# Altium project rpi_adapter.PrjPcb
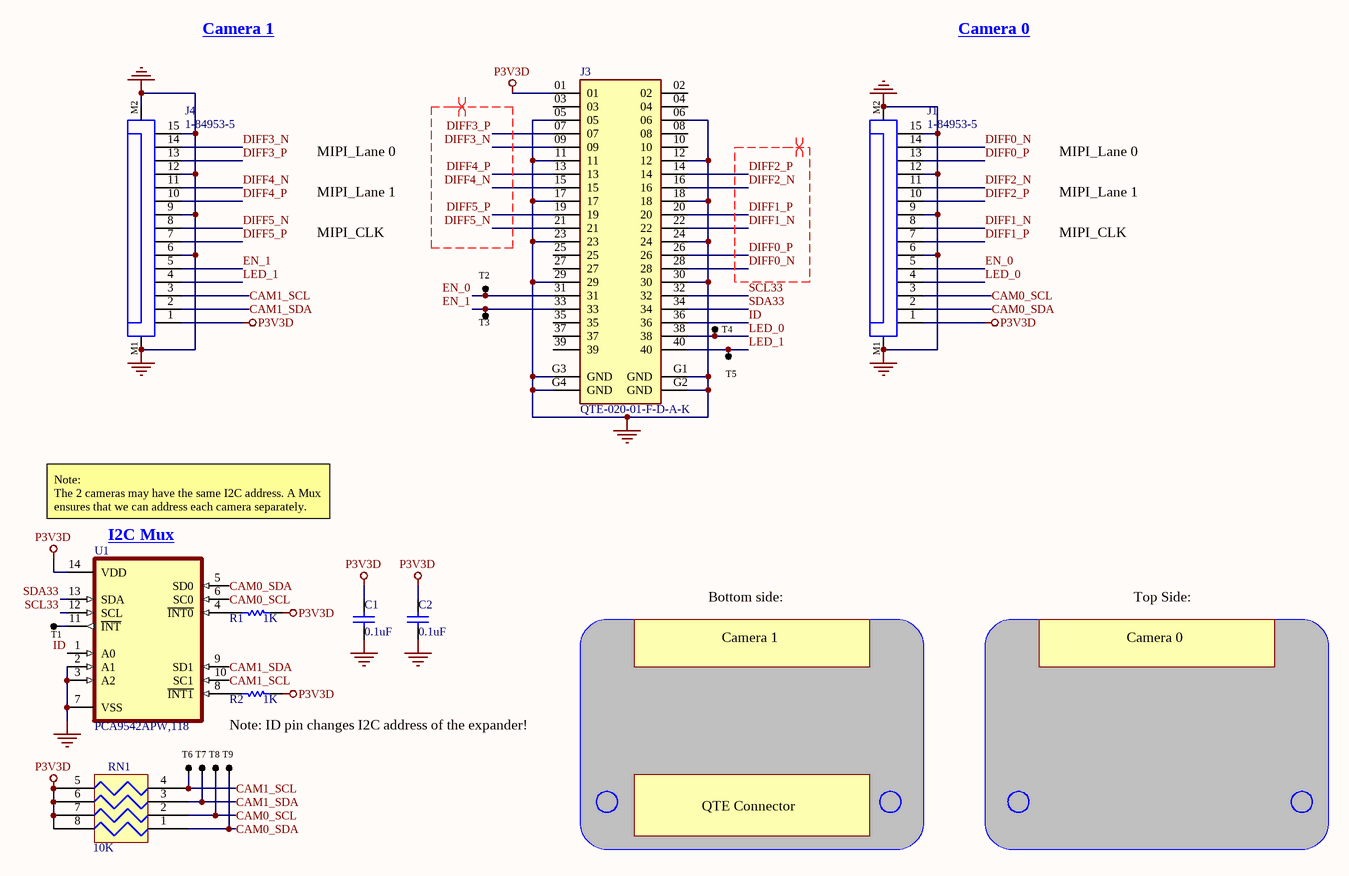
[diagram p0: rpi_adapter_2x4L_sink.SchDoc]
SCH_NAME: tinyDualRPi Adapter; REV: v2.0; PCB_NAME: tinyDualRPi Adapter
1 sheet, 18 parts. Net scope: global (net labels, ports and power ports of the same name join across sheets).
Board file: rpi_adapter.PcbDoc

## Sheet rpi_adapter_2x4L_sink.SchDoc
size B; SheetNumber: 1; SheetTotal: 1

### Parts
C1  0.1uF  [CAPC1005X55USR]
C2  0.1uF  [CAPC1005X55USR]
J1  1-84953-5  [TE_1-84953-5]
J3  QTE-020-01-F-D-A-K  [SAMTEC_QTE-020-01-X-D-A]
J4  1-84953-5  [TE_1-84953-5]
R1  1K  [RESC1005X40USR]
R2  1K  [RESC1005X40USR]
RN1  10K  [RESCAXS50P100X200X45-8NA]
T1  TP_S  [TP 1mm]  (value not drawn)  (no BOM)
T2  TP_S  [TP 1mm]  (value not drawn)  (no BOM)
T3  TP_S  [TP 1mm]  (value not drawn)  (no BOM)
T4  TP_S  [TP 1mm]  (value not drawn)  (no BOM)
T5  TP_S  [TP 1mm]  (value not drawn)  (no BOM)
T6  TP_S  [TP 1mm]  (value not drawn)  (no BOM)
T7  TP_S  [TP 1mm]  (value not drawn)  (no BOM)
T8  TP_S  [TP 1mm]  (value not drawn)  (no BOM)
T9  TP_S  [TP 1mm]  (value not drawn)  (no BOM)
U1  PCA9542APW,118  [SOP65P640X110-14N]

### Nets
GND: C1.1 C2.1 J1.6 J1.9 J1.12 J1.15 J1.M1 J1.M2 J3.05 J3.06 J3.11 J3.12 J3.17 J3.18 J3.23 J3.24 J3.29 J3.30 J3.G1(GND) J3.G2(GND) J3.G3(GND) J3.G4(GND) J4.6 J4.9 J4.12 J4.15 J4.M1 J4.M2 U1.2(A1) U1.3(A2) U1.7(VSS)
P3V3D: C1.2 C2.2 J1.1 J3.01 J4.1 R1.2 R2.2 RN1.5 RN1.6 RN1.7 RN1.8 U1.14(VDD)
CAM0_SCL: J1.3 RN1.2 T8.1 U1.6(SC0)
CAM0_SDA: J1.2 RN1.1 T9.1 U1.5(SD0)
CAM1_SCL: J4.3 RN1.4 T6.1 U1.10(SC1)
CAM1_SDA: J4.2 RN1.3 T7.1 U1.9(SD1)
DIFF0_N: J1.14 J3.28
DIFF0_P: J1.13 J3.26
DIFF1_N: J1.8 J3.22
DIFF1_P: J1.7 J3.20
DIFF2_N: J1.11 J3.16
DIFF2_P: J1.10 J3.14
DIFF3_N: J3.09 J4.14
DIFF3_P: J3.07 J4.13
DIFF4_N: J3.15 J4.11
DIFF4_P: J3.13 J4.10
DIFF5_N: J3.21 J4.8
DIFF5_P: J3.19 J4.7
EN_0: J1.5 J3.31 T2.1
EN_1: J3.33 J4.5 T3.1
ID: J3.36 U1.1(A0)
LED_0: J1.4 J3.38 T4.1
LED_1: J3.40 J4.4 T5.1
SCL33: J3.32 U1.12(SCL)
SDA33: J3.34 U1.13(SDA)
NetR1_1: R1.1 U1.4(~{INT0})
NetR2_1: R2.1 U1.8(~{INT1})
NetT1_1: T1.1 U1.11(~{INT})

Not connected (* = marked no-connect by the designer): J3 02 03 04 08 10 25 27 35 37 39

### Layout directives
differential pair: DIFF0_N, DIFF0_P, DIFF1_N, DIFF1_P, DIFF2_N, DIFF2_P, DIFF3_N, DIFF3_P, DIFF4_N, DIFF4_P, DIFF5_N, DIFF5_P

### Notes on the sheet
- Camera 1
- Camera 0
- MIPI_Lane 0
- MIPI_CLK
- MIPI_Lane 1
- Note:
  The 2 cameras may have the same I2C address. A Mux ensures that we can address each camera separately.
- (near U1) I2C Mux
- Bottom side:
- Top Side:
- Note: ID pin changes I2C address of the expander!
- QTE Connector

### Library data of the parts
C1 C2 = CAP CER 0.1UF 16V X7R 0402: Manufacturer Part Number: CGA2B1X7R1C104K050BC; Manufacturer: TDK Corporation; Supplier Part Number 1: 445-5613-2-ND; Package: 0402; Height: 0.55mm; Supplier 1: Digi-Key; value: 0.1uF
J1 J4 = FPC - 15P - 2MP: Conn FPC Connector SKT 15 POS 1mm Solder RA SMD T/R; Manufacturer: TE Connectivity; Actuator Material: Nylon,Glass,Polyamide; Actuator Color: Black; Voltage Rating: 200V; Number of Contacts: 15; Current Rating: 1A; Gender: Receptacle; Wire/Cable Type: Flat Flex; Shielding: Unshielded; Connector Type: Receptacle,Connector,Socket; Connector System: Flex-to-Board; Mating Alignment: Yes (With); PCB Mount Alignment: No (Without); PCB Mount Retention: With; Contact Location: Top; PCB Mounting Orientation: Right Angle; Pitch: 0.039inch; Plating Thickness: 2um; Supplier 1: Digi-Key; Supplier Part Number 1: A101405CT-ND; Manufacturer Part Number: 1-84953-5; RoHS: Yes; Category: FFC / FPC; Stock 1: 9836; Pricing 1: 1=1.02000, 10=0.97700, 25=0.93400, 50=0.92100, 100=0.80470, 250=0.77460, 500=0.73158 (USD); Mount: Surface Mount; Contact Plating: Tin,Bright; Contact Material: Bronze; Housing Color: Natural; Housing Material: Polymer; Min Operating Temperature: -40°C; Max Operating Temperature: 85°C; Termination: SMD/SMT; Packaging: Tape and Reel; Number of Rows: 1; Package Quantity: 1200; Orientation: Right Angle; Series: FPC; Number of Positions: 15; Sealable: No (Without); Shrouded: Yes (With); Contact Current Rating: 1A; Max Voltage Rating (AC): 200V; Length: 22.92mm; Width: 0.2575inch; Height: 2.56mm; Depth: 7.3mm; Radiation Hardening: No; RoHS Compliant: Yes; Flammability Rating: UL94 V-0; ELV: Compliant; ComponentLink1URL: https://datasheet.ciiva.com/669/eng-cd-84953-a3-669110.pdf?src-supplier=Digi-Key; ComponentLink1Description: https://datasheet.ciiva.com/669/eng-cd-84953-a3-669110.pdf?src-supplier=Digi-Key; ComponentLink2URL: https://datasheet.ciiva.com/669/eng-cd-84953-a3-669111.pdf?src-supplier=Digi-Key; ComponentLink2Description: https://datasheet.ciiva.com/669/eng-cd-84953-a3-669111.pdf?src-supplier=Digi-Key; ComponentLink3URL: https://datasheet.ciiva.com/669/eng-cd-84953-a3-669112.pdf?src-supplier=Digi-Key; ComponentLink3Description: https://datasheet.ciiva.com/669/eng-cd-84953-a3-669112.pdf?src-supplier=Digi-Key
J3 = QSE-020-01-F-D-A-K: Q Strip® High-Speed Ground Plane Header, 0.80mm Pitch; Manufacturer: Samtec; Number of Positions: 40; Gender: Male; Pitch: 0.031inch; Mated Stacking Heights: 5mm; Supplier 1: Digi-Key; Supplier Part Number 1: SAM8846-ND; Manufacturer Part Number: QTE-020-01-F-D-A; RoHS: Yes; Category: Board to Board Connectors; Stock: 179; Pricing: 1=5.61000, 10=5.09400, 25=4.82480, 40=4.71275, 80=4.48825, 230=3.92726, 440=3.81505, 945=3.25402, 2400=3.02960 (USD); Mounting Technology: Surface Mount; Contact Plating: Gold; Number of Rows: 2; Packaging: Tray; Termination: Solder; Number of Contacts: 40; Series: QStrip® QTE; Package Quantity: 1; RoHS Compliant: Yes; ComponentLink1URL: https://datasheet.ciiva.com/6924/qte-xxx-xx-x-d-xxx-mkt-6924765.pdf?src-supplier=Digi-Key; ComponentLink1Description: https://datasheet.ciiva.com/6924/qte-xxx-xx-x-d-xxx-mkt-6924765.pdf?src-supplier=Digi-Key
R1 R2 = RES 1K OHM 1% 1/16W 0402: RES SMD 1K OHM 1% 1/16W 0402; Manufacturer: YAGEO; Manufacturer Part Number: RC0402FR-071KL; Supplier Part Number 1: 311-1.00KLRCT-ND; Package: 0402; Height: 0.4mm; Supplier 1: Digi-Key; value: 1K
RN1 = RES ARRAY 4 RES 47K OHM 0804: Res Thick Film Array 10K Ohm 5% ±200ppm/°C ISOL 8-Pin 0804(4 X 0402) Convex SMD Automotive T/R; Manufacturer: Panasonic; Manufacturer Part Number: EXB-28V103JX; Number of Resistors: 4; Power Dissipation: 63mW; Voltage Rating: 50V; Circuit Type: Isolated; Power Per Element: 62.5mW; Number of Contacts: 8; Voltage Rating (DC): 100V; Supplier 1: Digi-Key; Supplier Part Number 1: Y7103CT-ND; RoHS: Yes; Category: Resistor Arrays; Stock: 1570078; Pricing: 1=0.10000, 10=0.08100, 25=0.05640, 50=0.04380, 100=0.03130, 250=0.02444, 500=0.01942, 1000=0.01378, 5000=0.01065 (USD); Mounting Technology: Surface Mount; Case/Package: 0804; Pins: 8; Case Code (Metric): 1005; Case Code (Imperial): 0402; Min Operating Temperature: -55°C; Max Operating Temperature: 125°C; Value: 10K; Packaging: Tape and Reel; Package Quantity: 1; Temperature Coefficient: 200ppm/°C; Series: EXB; Tolerance: 5%; Number of Elements: 4; Termination: Convex; Resistance Tolerance: 5%; Technology: THICK FILM; Length: 2mm; Width: 1mm; Height: 0.35mm; Depth: 1mm; Terminal Pitch: 0.5mm; Radiation Hardening: No; Lead Free: Lead Free; RoHS Compliant: Yes; Military Standard: Not; Reach SVHC Compliant: Unknown; ComponentLink1URL: https://datasheet.ciiva.com/46387/1480003-46387949.pdf?src-supplier=Element14; ComponentLink1Description: https://datasheet.ciiva.com/46387/1480003-46387949.pdf?src-supplier=Element14; ComponentLink2URL: https://datasheet.ciiva.com/46376/1480003-46376265.pdf?src-supplier=Element14; ComponentLink2Description: https://datasheet.ciiva.com/46376/1480003-46376265.pdf?src-supplier=Element14; ComponentLink3URL: https://datasheet.ciiva.com/28418/1790599-28418558.pdf?src-supplier=Element14; ComponentLink3Description: https://datasheet.ciiva.com/28418/1790599-28418558.pdf?src-supplier=Element14; ComponentLink4URL: https://datasheet.ciiva.com/28636/1790599-28636885.pdf?src-supplier=Element14; ComponentLink4Description: https://datasheet.ciiva.com/28636/1790599-28636885.pdf?src-supplier=Element14; ComponentLink5URL: https://datasheet.ciiva.com/30209/aoc0000ce1-30209125.pdf?src-supplier=Onlinecomponents.com; ComponentLink5Description: https://datasheet.ciiva.com/30209/aoc0000ce1-30209125.pdf?src-supplier=Onlinecomponents.com
T1-T9 = TP_S: test point
U1 = PCA9542APW,118: PCA9542A Series 2-Channel I2C-bus Multiplexer with Interrupt Logic - TSSOP - 14; Manufacturer: NXP Semiconductors; Propagation Delay: 0.3ns; Min Supply Voltage: 2.3V; Max Supply Voltage: 5.5V; Number of Channels: 2; Operating Supply Voltage: 5V; Interface: I2C,SMBus; Clock Frequency: 400kHz; Supply Current: 100mA; Number of Outputs: 1; Power Dissipation: 400mW; Max Supply Current: 25uA; Low Level Output Current: 10mA; High Level Output Current: -10uA; Nominal Supply Voltage: 3.6V; Supplier 1: Digi-Key; Supplier Part Number 1: 568-1856-1-ND; Manufacturer Part Number: PCA9542APW,118; RoHS: Yes; Category: Interface ICs; Stock: 18695; Pricing: 1=2.50000, 10=2.24900, 25=2.12160, 100=1.80750, 250=1.69720, 500=1.48506, 1000=1.23047 (USD); Mounting Technology: Surface Mount; Case/Package: TSSOP; Pins: 14; Weight: 0.004949oz; Min Operating Temperature: -40°C; Max Operating Temperature: 85°C; Packaging: Tape and Reel; Package Quantity: 1; Logic Function: Multiplexer; Series: -; Number of Inputs: 2; Number of Input Lines: 2; Number of Output Lines: 1; Length: 5.1mm; Width: 4.5mm; Height: 0.95mm; Radiation Hardening: No; Lead Free: Lead Free; RoHS Compliant: Yes; ComponentLink1URL: https://datasheet.ciiva.com/4806/pca9542a-185703-4806721.pdf?src-supplier=Mouser; ComponentLink1Description: https://datasheet.ciiva.com/4806/pca9542a-185703-4806721.pdf?src-supplier=Mouser; ComponentLink2URL: https://datasheet.ciiva.com/15087/getdatasheetpartid-214981-15087231.pdf?src-supplier=Verical; ComponentLink2Description: https://datasheet.ciiva.com/15087/getdatasheetpartid-214981-15087231.pdf?src-supplier=Verical; ComponentLink3URL: https://datasheet.ciiva.com/8242/pca9542a-8242759.pdf?src-supplier=Avnet; ComponentLink3Description: https://datasheet.ciiva.com/8242/pca9542a-8242759.pdf?src-supplier=Avnet; ComponentLink4URL: https://datasheet.ciiva.com/1784/pca9542a-1784041.pdf?src-supplier=Digi-Key; ComponentLink4Description: https://datasheet.ciiva.com/1784/pca9542a-1784041.pdf?src-supplier=Digi-Key; ComponentLink5URL: https://datasheet.ciiva.com/1784/pca9542a-1784042.pdf?src-supplier=Digi-Key; ComponentLink5Description: https://datasheet.ciiva.com/1784/pca9542a-1784042.pdf?src-supplier=Digi-Key; ComponentLink6URL: https://datasheet.ciiva.com/1784/pca9542a-1784043.pdf?src-supplier=Digi-Key; ComponentLink6Description: https://datasheet.ciiva.com/1784/pca9542a-1784043.pdf?src-supplier=Digi-Key; ComponentLink7URL: https://datasheet.ciiva.com/16219/pca9542a-16219928.pdf?src-supplier=Future+Electronics; ComponentLink7Description: https://datasheet.ciiva.com/16219/pca9542a-16219928.pdf?src-supplier=Future+Electronics

## Assembly variants
v2.0: all parts fitted